# EAGLE design MinieasyMySens-v003 (EAGLE 7.3.0)
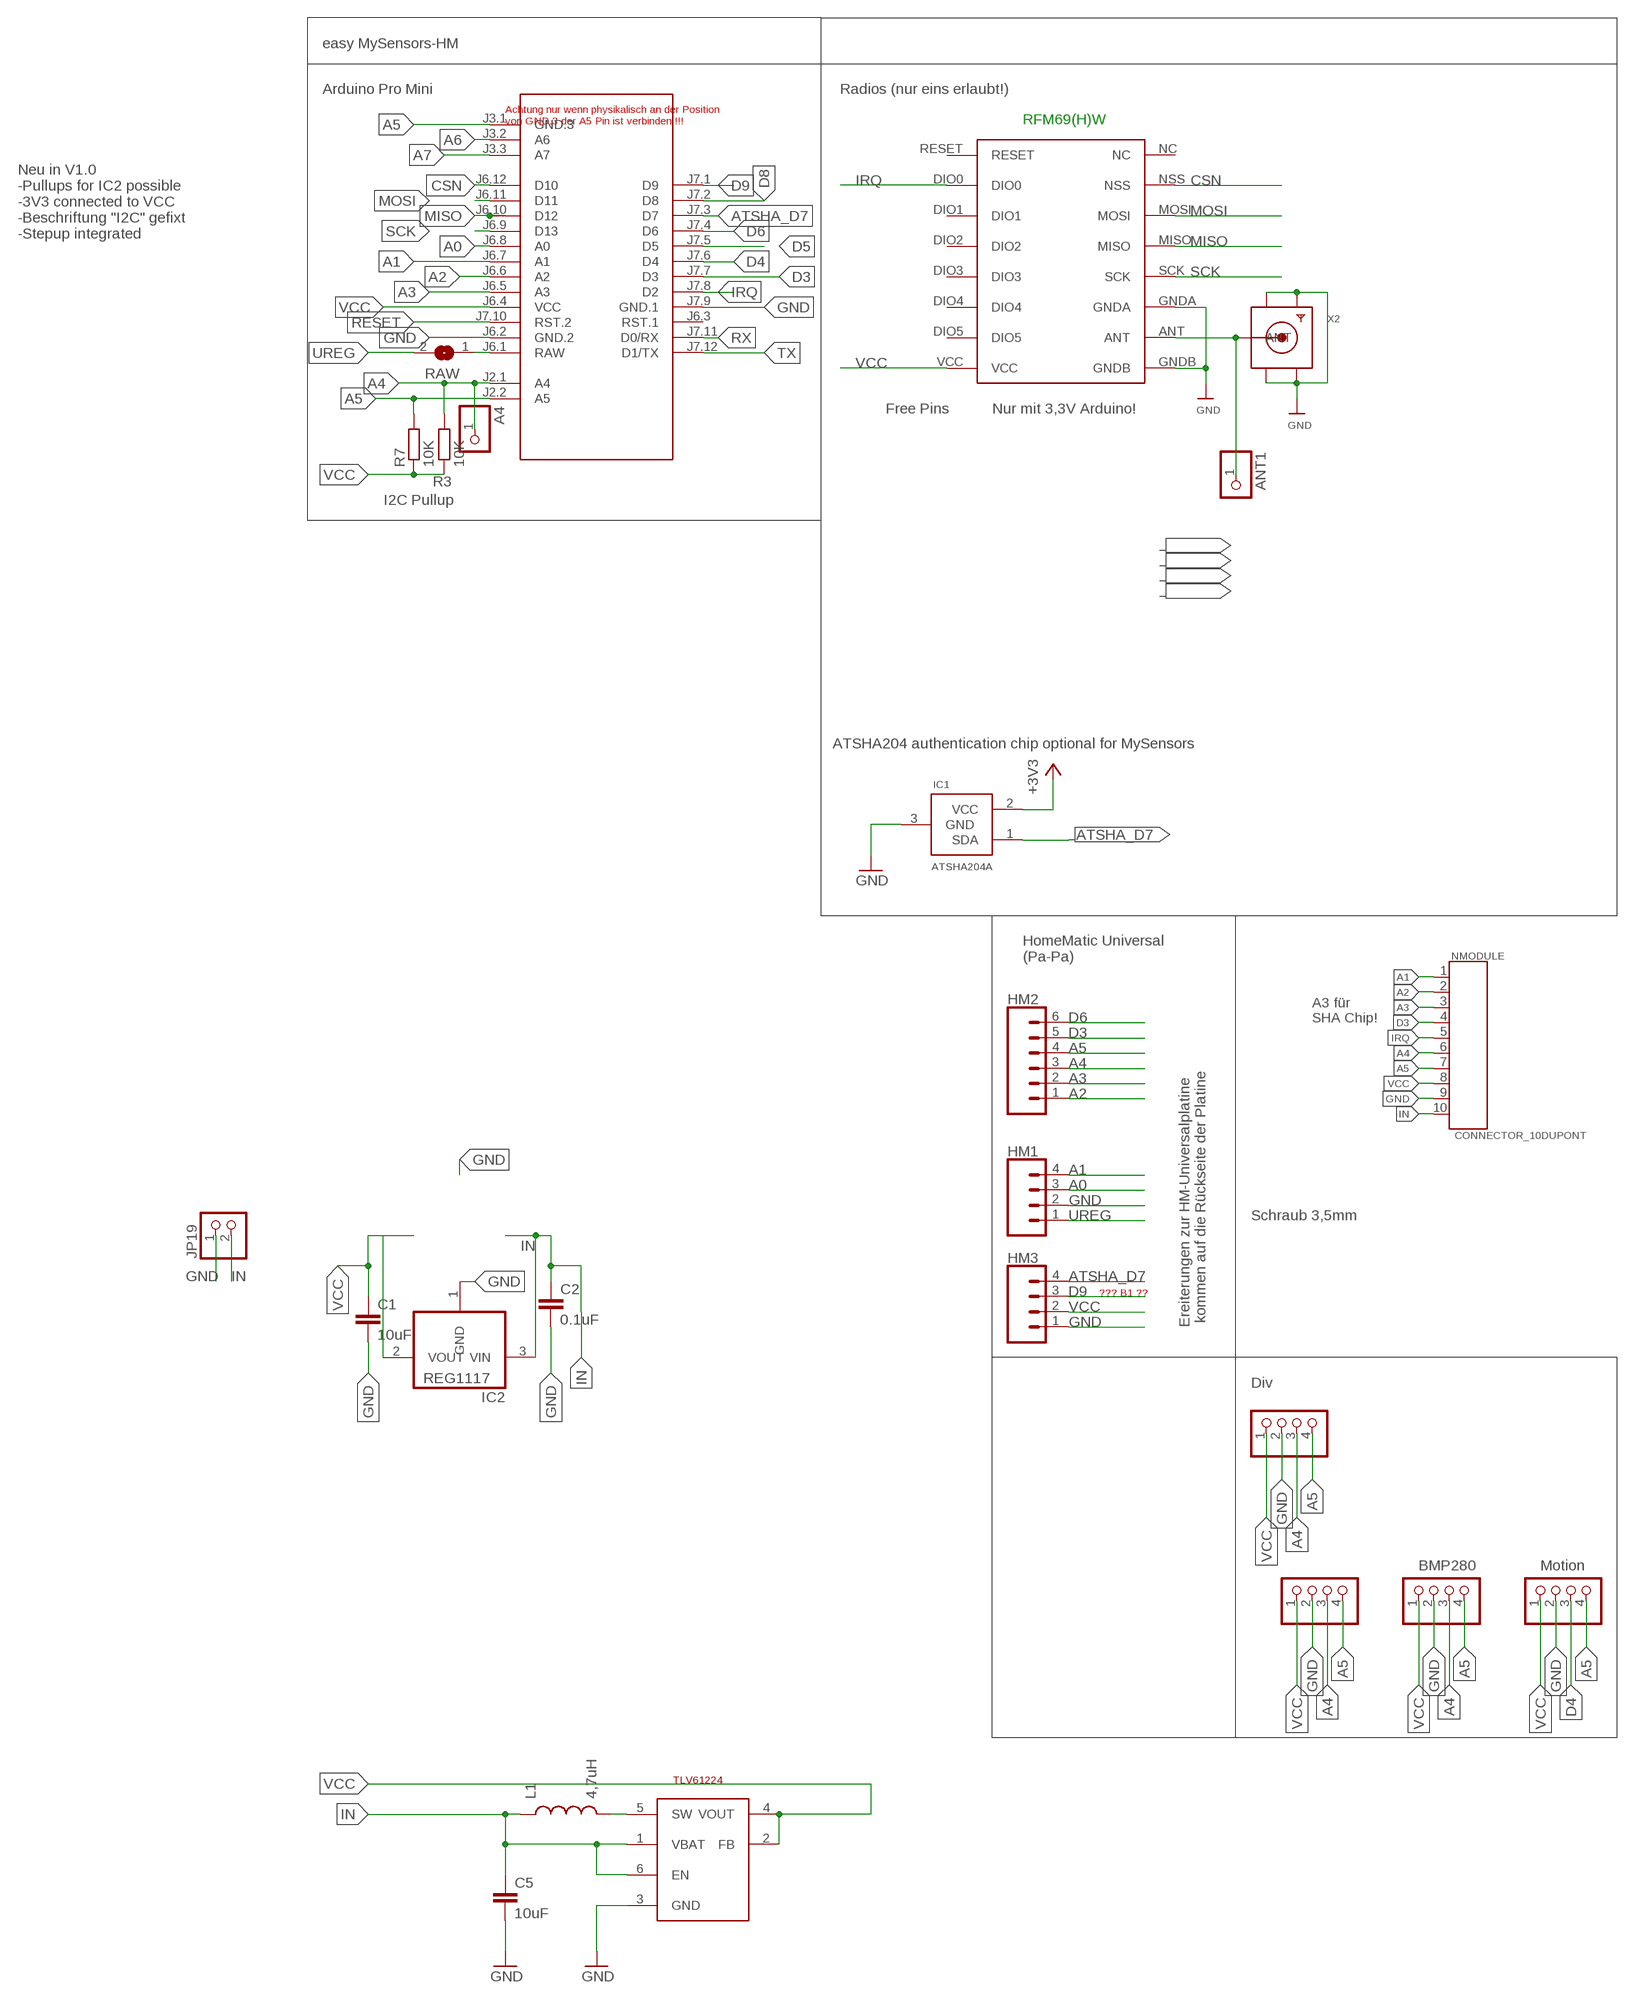
[diagram p0: schematic, sheet 1]

## Parts
A4  PINHD-1X1  [1X01]
ANT1  PINHD-1X1  [1X01]
BH1750  PINHD-1X04_2.54-S  [1X04-S]
C1  10uF  C-EUC1210  [C1210]
C2  0.1uF  C-EUC1206  [C1206]
C5  10uF  CAP0805  [0805]
HM1  CONN_04  [1X04]
HM2  CONN_06SILK_FEMALE_PTH  [1X06]
HM3  CONN_04  [1X04]
I2C-1  PINHD-1X04_2.54-S  [1X04-S]
I2C-2  PINHD-1X04_2.54-S  [1X04-S]
IC1  ATSHA204A  [SOT23]
IC2  REG1117  [SOT223]
JP19  PINHD-1X2  [1X02]
L1  4,7uH  INDUCTOR0805  [0805]
M1  ARDUINO-PRO-MINI-3.3V#NP  [ARDUINO-PRO-MINI#NP]
MOTION  PINHD-1X04_2.54-S  [1X04-S]
NMODULE  CONNECTOR_10DUPONT  [DUPONT_10]
R3  10K  R-EU_R0805  [R0805]
R7  10K  R-EU_R0805  [R0805]
RAW  SJ  [SJ]
RFM69W  RFM69HW  [RFM]
STEPUP  TLV61224  TI-TLV61224  [SOT23-6L]
X2  SMACONNECTOR_EDGE  [SMA_EDGELAUNCH]

## Nets
A0: HM1.3 M1.J6.8(A0)
A1: HM1.4 M1.J6.7(A1) NMODULE.1
A2: HM2.1 M1.J6.6(A2) NMODULE.2
A3: HM2.2 M1.J6.5(A3) NMODULE.3
A4: A4.1 BH1750.3 HM2.3 I2C-1.3 I2C-2.3 M1.J2.1(A4) NMODULE.6 R3.2
A5: BH1750.4 HM2.4 I2C-1.4 I2C-2.4 M1.J2.2(A5) M1.J3.1(GND.3) MOTION.4 NMODULE.7 R7.2
A6: M1.J3.2(A6)
A7: M1.J3.3(A7)
ATSHA_D7: HM3.4 IC1.1(SDA) M1.J7.3(D7)
CSN: M1.J6.12(D10) RFM69W.NSS
D3: HM2.5 M1.J7.7(D3) NMODULE.4
D4: M1.J7.6(D4) MOTION.3
D5: M1.J7.5(D5)
D6: HM2.6 M1.J7.4(D6)
D8: M1.J7.2(D8)
D9: HM3.3 M1.J7.1(D9)
GND [Power]: BH1750.2 C1.2 C2.2 C5.2 HM1.2 HM3.1 I2C-1.2 I2C-2.2 IC1.3(GND) IC2.1(GND) JP19.1 M1.J6.2(GND.2) M1.J7.9(GND.1) MOTION.2 NMODULE.9 RFM69W.GNDA RFM69W.GNDB STEPUP.3(GND) X2.GND@1(GND4) X2.GND@2(GND3) X2.GND@3(GND2) X2.GND@4(GND1)
IN [Power]: C2.1 C5.1 IC2.3(VIN) JP19.2 L1.1 NMODULE.10 STEPUP.1(VBAT) STEPUP.6(EN)
IRQ: M1.J7.8(D2) NMODULE.5 RFM69W.DIO0
MISO: M1.J6.10(D12) RFM69W.MISO
MOSI: M1.J6.11(D11) RFM69W.MOSI
N$13: L1.2 STEPUP.5(SW)
N$16: ANT1.1 RFM69W.ANT X2.P(ANT)
RAW [Power]: M1.J6.1(RAW) RAW.1
RESET: M1.J7.10(RST.2)
RX: M1.J7.11(D0/RX)
SCK: M1.J6.9(D13) RFM69W.SCK
TX: M1.J7.12(D1/TX)
UREG [Power]: HM1.1 RAW.2
VCC [Power]: BH1750.1 C1.1 HM3.2 I2C-1.1 I2C-2.1 IC1.2(VCC) IC2.2(VOUT) M1.J6.4(VCC) MOTION.1 NMODULE.8 R3.1 R7.1 RFM69W.VCC STEPUP.2(FB) STEPUP.4(VOUT) ; supply symbol labelled +3V3
Unconnected: M1.J6.3(RST.1) RFM69W.DIO1 RFM69W.DIO2 RFM69W.DIO3 RFM69W.DIO4 RFM69W.DIO5 RFM69W.NC RFM69W.RESET

## Notes on the sheet
- easy MySensors-HM
- Arduino Pro Mini | Radios (nur eins erlaubt!)
- Achtung nur wenn physikalisch an der Position 
  von GND.3 der A5 Pin ist verbinden !!!
- RFM69(H)W
- Neu in V1.0
  -Pullups for IC2 possible
  -3V3 connected to VCC
  -Beschriftung "I2C" gefixt
  -Stepup integrated
- Free Pins | Nur mit 3,3V Arduino!
- I2C Pullup
- ATSHA204 authentication chip optional for MySensors
- HomeMatic Universal
  (Pa-Pa)
- A3 für 
  SHA Chip!
- Schraub 3,5mm
- ??? B1 ??
- Ereiterungen zur HM-Universalplatine
   kommen auf die Rückseite der Platine
- Div
- BMP280 | Motion

## Library data of the parts
A4 ANT1 = pinhead:PINHD-1X1: PIN HEADER
BH1750 I2C-1 I2C-2 MOTION = pinhead-2:PINHD-1X04: PIN HEADER
C1 C2 = rcl:C-EU: CAPACITOR, European symbol
C5 = SparkFun-Passives:CAP: Capacitor Standard 0603 ceramic capacitor, and 0.1" leaded capacitor.
HM1 HM3 = SparkFun-Connectors:CONN_04: Multi connection point. Often used as Generic Header-pin footprint for 0.1 inch spaced/style header connections On any of the 0.1 inch spaced packages, you can populate with these: Break Away Headers - Straight <https://www.sparkfun.com/products/116> (PRT-00116) Break Away Male Headers - Right Angle <https://www.sparkfun.com/products/553> (PRT-00553) Female Headers <https://www.sparkfun.com/products/115> (PRT-00115) Break Away Headers - Machine Pin <https://www.sparkfun.com/products/117> (PRT-00117) Break Away Female Headers - Swiss Machine Pin <https://www.sparkfun.com/products/743> (PRT-00743) For SCREWTERMINALS and SPRING TERMINALS visit here: Screw Terimnals on SparkFun.com <https://www.sparkfun.com/search/results?term=Screw+Terminals> (5mm/3.5mm/2.54mm spacing) This device is also useful as a general connection point to wire up your design to another part of your project. Our various solder wires solder well into these plated through hole pads. Hook-Up Wire - Assortment (Stranded, 22 AWG) <https://www.sparkfun.com/products/11375> (PRT-11375) Hook-Up Wire - Assortment (Solid Core, 22 AWG) <https://www.sparkfun.com/products/11367> (PRT-11367) View the entire wire category on our website here <https://www.sparkfun.com/categories/141> Special notes: Molex polarized connector foot print use with SKU : PRT-08231 with associated crimp pins and housings. 1MM SMD Version SKU: PRT-10208; PROD_ID: CONN-09696
HM2 = SparkFun-Connectors:CONN_06: Multi connection point. Often used as Generic Header-pin footprint for 0.1 inch spaced/style header connections On any of the 0.1 inch spaced packages, you can populate with these: Break Away Headers - Straight <https://www.sparkfun.com/products/116> (PRT-00116) Break Away Male Headers - Right Angle <https://www.sparkfun.com/products/553> (PRT-00553) Female Headers <https://www.sparkfun.com/products/115> (PRT-00115) Break Away Headers - Machine Pin <https://www.sparkfun.com/products/117> (PRT-00117) Break Away Female Headers - Swiss Machine Pin <https://www.sparkfun.com/products/743> (PRT-00743) Arduino Stackable Header - 6 Pin <https://www.sparkfun.com/products/9280> (PRT-09280) For SCREWTERMINALS and SPRING TERMINALS visit here: Screw Terimnals on SparkFun.com <https://www.sparkfun.com/search/results?term=Screw+Terminals> (5mm/3.5mm/2.54mm spacing) This device is also useful as a general connection point to wire up your design to another part of your project. Our various solder wires solder well into these plated through hole pads. Hook-Up Wire - Assortment (Stranded, 22 AWG) <https://www.sparkfun.com/products/11375> (PRT-11375) Hook-Up Wire - Assortment (Solid Core, 22 AWG) <https://www.sparkfun.com/products/11367> (PRT-11367) View the entire wire category on our website here <https://www.sparkfun.com/categories/141>; PROD_ID: CONN-08437
IC1 = Sensor:ATSHA204A
IC2 = burr-brown:REG1117: 800mA and 1A Low Dropout (LDO) Positive Regulator 1.8V, 2.5V, 2.85V, 3.3V, 5V, and Adj; MPN: REG1117; OC_FARNELL: 1097566; OC_NEWARK: 14P6981
JP19 = pinhead:PINHD-1X2: PIN HEADER
L1 = SparkFun-Passives:INDUCTOR: Inductors Basic Inductor/Choke - 0603 and 1206. Footprints are not proven and vary greatly between part numbers.
M1 = diy-modules:ARDUINO-PRO-MINI-*#NP: Arduino Pro Mini without programming pads
NMODULE = TD-MySensors:CONNECTOR_10
R3 R7 = rcl:R-EU_: RESISTOR, European symbol
RAW = jumper:SJ: SMD solder JUMPER
RFM69W = hoperf:RFM69HW
STEPUP = TLV61224:TI-TLV61224
X2 = adafruit:SMACONNECTOR: SMA Connector 90° DIP SMA Connector, 50 Ohm (4UConnector: 07259)

## Net classes
0 default: width 0.305 mm
1 Power: width 0.508 mm

## Board
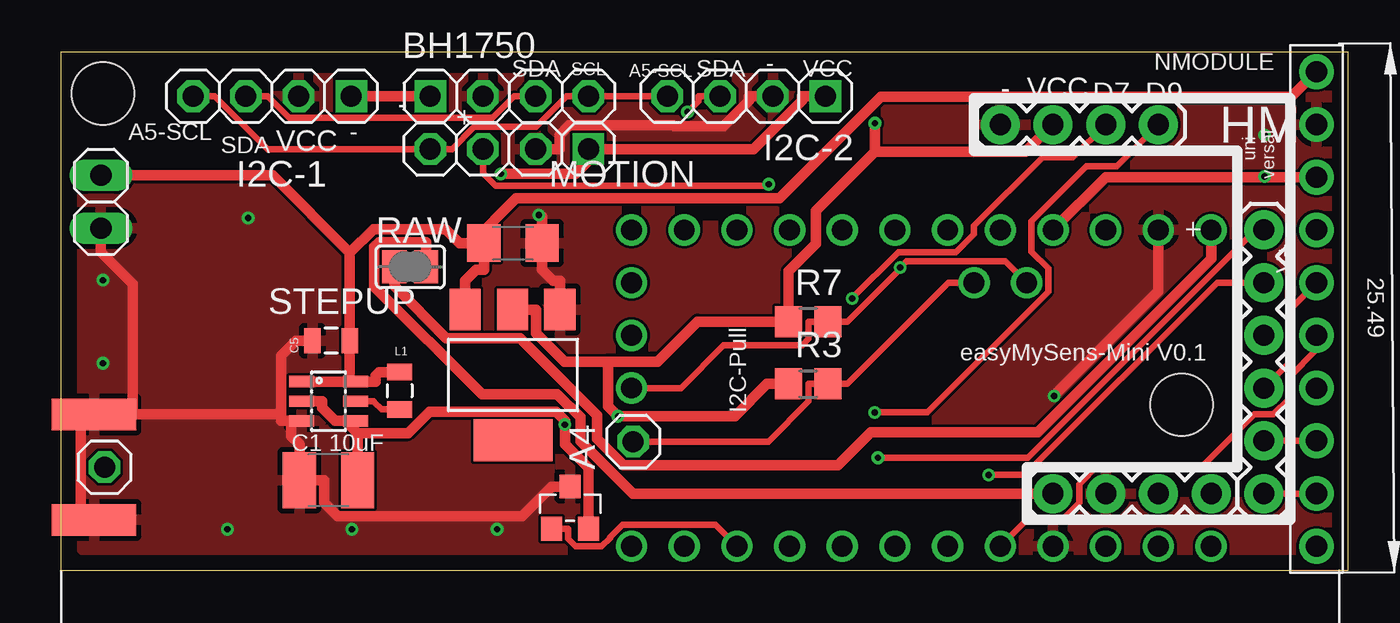
[diagram p1: board, top side]
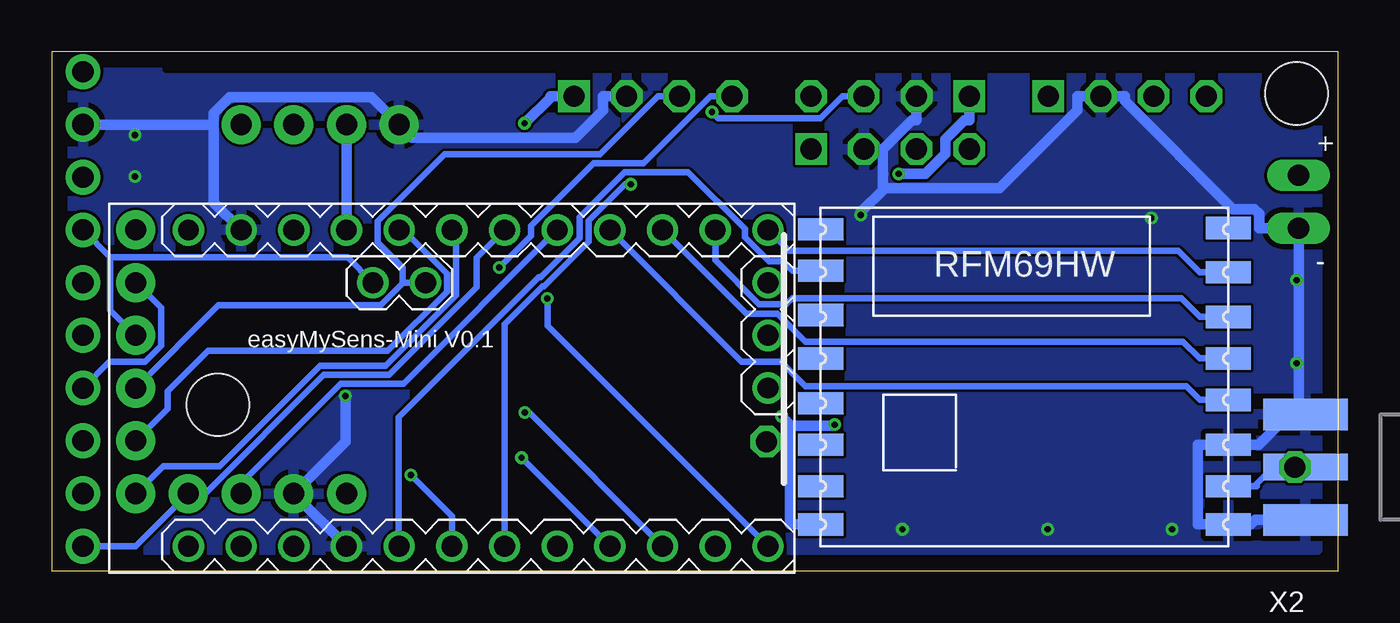
[diagram p2: board, bottom side, seen from below]

Size 62 x 25 mm. Coordinates in mm from the lower left corner, seen from the top.
Outline: 62,0 0,0 0,25 62,25 62,0
Copper layers (1*16): Top 0.035mm / dielectric 1.5mm / Bottom 0.035mm
Design rules "dirt_cheap_dirty_boards.v1": minimum track width 5mil, minimum drill 12mil, track to track 5mil, track to pad 5mil, pad to pad 5mil, via to via 5mil, smd to smd 0mil, copper to edge 10mil, drill to drill 10mil, minimum pad ring 10mil, minimum via ring 6mil, stop-mask expansion 2mil, vias tented up to drill 25mil, thermal gap 10mil
Holes 3 mm at 2,23 54,8
tRestrict: area 0,24.1 to 56.5,25.4; 2 lines
bRestrict: area 0,24.1 to 56.5,25.4; 2 lines

### Footprints (pad centres in the part's own frame; a part is rotated, then mirrored left to right if it is on the bottom)
1X01 = drill 1.016 octagon: 1 0,0
1X04-S = drill 1.016 square: 1 -3.81,0 | drill 1.016 octagon: 2 -1.27,0; 3 1.27,0; 4 3.81,0
C1210 = smd 1.6 x 2.7: 1 -1.4,0; 2 1.4,0
C1206 = smd 1.6 x 1.8: 1 -1.4,0; 2 1.4,0
0805 = smd 0.8 x 1.2: 1 -0.9,0; 2 0.9,0
1X04 = drill 1.016 pad 1.88: 1 0,0; 2 2.54,0; 3 5.08,0; 4 7.62,0
1X06 = drill 1.016 pad 1.88: 1 0,0; 2 2.54,0; 3 5.08,0; 4 7.62,0; 5 10.16,0; 6 12.7,0
SOT23 = smd 1.016 x 1.143: 1 -0.889,-1.016; 2 0.889,-1.016; 3 0,1.016
SOT223 = smd 1.499 x 2.007: 1 -2.261,-3.15; 2 0.025,-3.15; 3 2.311,-3.15 | smd 3.81 x 2.007: 4 0,3.15
1X02 = drill 1.016 long: 1 -1.27,0; 2 1.27,0
ARDUINO-PRO-MINI#NP = drill 1: J2.1 -1.27,5.08; J2.2 -3.81,5.08; J3.1 15.24,0; J3.2 15.24,2.54; J3.3 15.24,5.08; J6.1 -12.7,7.62; J6.2 -10.16,7.62; J6.3 -7.62,7.62; J6.4 -5.08,7.62; J6.5 -2.54,7.62; J6.6 0,7.62; J6.7 2.54,7.62; J6.8 5.08,7.62; J6.9 7.62,7.62; J6.10 10.16,7.62; J6.11 12.7,7.62; J6.12 15.24,7.62; J7.1 15.24,-7.62; J7.2 12.7,-7.62; J7.3 10.16,-7.62; J7.4 7.62,-7.62; J7.5 5.08,-7.62; J7.6 2.54,-7.62; J7.7 0,-7.62; J7.8 -2.54,-7.62; J7.9 -5.08,-7.62; J7.10 -7.62,-7.62; J7.11 -10.16,-7.62; J7.12 -12.7,-7.62
DUPONT_10 = drill 1.016 pad 1.676: 1 1.27,1.27; 2 3.81,1.27; 3 6.35,1.27; 4 8.89,1.27; 5 11.43,1.27; 6 13.97,1.27; 7 16.51,1.27; 8 19.05,1.27; 9 21.59,1.27; 10 24.13,1.27
R0805 = smd 1.3 x 1.5: 1 -0.95,0; 2 0.95,0
SJ = smd 1.168 x 1.6: 1 -0.762,0; 2 0.762,0
RFM = smd 2.184 x 1.067: ANT 19.651,2.889; DIO0 0,13.27; DIO1 0,11.143; DIO2 0,9.047; DIO3 0,6.889; DIO4 0,4.889; DIO5 0,2.889; GNDA 19.651,4.889; GNDB 19.651,1.048; MISO 19.651,9.047; MOSI 19.651,11.047; NC 19.651,15.334; NSS 19.651,13.206; RESET 0,15.27; SCK 19.651,7.048; VCC 0,1.048
SOT23-6L = smd 0.55 x 1.2: 1 -0.95,-1.3; 2 0,-1.3; 3 0.95,-1.3; 4 0.95,1.3; 5 0,1.3; 6 -0.95,1.3
SMA_EDGELAUNCH = smd 4.064 x 1.524: GND@1 2.032,-2.54; GND@2 2.032,2.54 | smd 4.064 x 1.524 bottom: GND@3 2.032,2.54; GND@4 2.032,-2.54 | smd 4.064 x 1.27: P 2.032,0

### Placement (x,y rotation side)
A4  27.56,6.22 90 top
ANT1  2.08,4.99 0 top
BH1750  21.59,22.86 0 top
C1  12.88,4.36 180 top
C2  21.77,15.79 0 top
C5  13,11.09 180 top
HM1  47.8,3.72 0 top
HM2  57.96,3.72 90 top
HM3  45.26,21.5 0 top
I2C-1  10.16,22.86 180 top
I2C-2  33.02,22.86 180 top
IC1  24.52,3.04 0 top
IC2  21.77,9.44 180 top
JP19  1.91,17.78 90 top
L1  16.3,8.67 270 top
M1  42.72,8.8 0 bottom
MOTION  21.59,20.32 180 top
NMODULE  61.77,-0.09 90 top
R3  36,9 0 top
R7  36,12 0 top
RAW  16.81,14.64 0 top
RFM69W  24.94,1.18 0 bottom
STEPUP  12.88,8.16 270 top
X2  -0.46,4.99 180 bottom

### Tracks (layer width: path | path; a pad name or v marks a point on that pad's centre or on a via)
A0
  Bottom 0.305: HM1.3 52.88,4.22 48.09,9.01 45.05,9.01 M1.J6.8
A1
  Bottom 0.305: M1.J6.7 41.52,15.08 41.52,13.66 45.74,9.44 48.89,9.44 54.61,3.72 HM1.4 57.96,1.18 NMODULE.1
A2
  Top 0.305: NMODULE.2 HM2.1
  Bottom 0.305: HM2.1 56.64,5.04 53.9,5.04 49.07,9.87 45.92,9.87 42.52,13.27 42.52,16.22 M1.J6.6
A3
  Top 0.305: NMODULE.3 HM2.2
  Bottom 0.305: HM2.2 56.41,7.81 56.41,8.65 54.46,10.6 45.81,10.6 42.96,13.45 42.96,14.31 45.06,16.42 M1.J6.5
A4  (via drill 0.3 pad 0.61)
  Top 0.305: v30.18,22.1 30.71,22.63 30.71,22.86 I2C-2.3 | I2C-1.3 9.93,22.86 10.97,21.82 20.78,21.82 21.82,22.86 BH1750.3 | A4.1 34.07,6.22 36.02,8.17 36.02,9 R3.2 37.88,9 42.76,13.88 M1.J2.1 | NMODULE.6 59.3,12.68 59.3,10.14 HM2.3
  Bottom 0.305: v30.18,22.1 29.89,21.81 24.95,21.81 23.9,22.86 BH1750.3 | 45.09,13.88 45.09,14.61 46.29,15.82 46.29,16.85 43.07,20.07 35.58,20.07 32.79,22.86 I2C-2.3 | HM2.3 53.98,12.78 46.16,12.78 45.09,13.85 45.09,13.88 | M1.J2.1 45.09,13.88
A5  (via drill 0.3 pad 0.61)
  Top 0.305: I2C-2.4 BH1750.4 24.36,22.86 22.89,21.39 19.89,21.39 18.82,20.32 MOTION.4 9.93,20.32 7.39,22.86 I2C-1.4 | M1.J2.2 45.49,14.92 40.74,14.92 v40.43,14.61 40.43,14.55 37.88,12 R7.2 36.87,12 36.02,12 36.02,11.17 35.71,10.86 31.92,10.86 29.86,8.8 M1.J3.1
  Bottom 0.305: I2C-2.4 30.25,22.86 33.47,19.64 35.88,19.64 38.91,16.62 38.91,16.13 v40.43,14.61 | 59.18,15.1 59.18,12.56 HM2.4 | NMODULE.7 59.18,15.1 | M1.J2.2 47.75,15.1 59.18,15.1
ATSHA_D7  (via drill 0.3 pad 0.61)
  Top 0.305: v39.21,7.63 41.74,7.63 47.56,13.45 47.56,14.58 46.76,15.38 46.76,16.85 49.41,19.49 50.87,19.49 HM3.4 | IC1.1 24.42,2.02 24.42,1.53 24.79,1.17 26.05,1.17 26.45,1.57 26.45,1.61 27.05,2.21 31.53,2.21 M1.J7.3
  Bottom 0.305: M1.J7.3 39.01,7.63 v39.21,7.63
CSN
  Bottom 0.305: RFM69W.NSS 6.66,14.39 7.69,15.42 26.48,15.42 M1.J6.12
D3  (via drill 0.3 pad 0.61)
  Top 0.305: v44.7,4.62 46.44,4.62 55.71,13.88 HM2.5
  Bottom 0.305: v44.7,4.62 42.72,2.64 M1.J7.7 | NMODULE.4 59.23,10.07 57.5,10.07 56.74,10.83 56.74,12.66 HM2.5
D4  (via drill 0.3 pad 0.61)
  Top 0.305: v34.1,18.62 34.01,18.54 20.94,18.54 20.32,19.16 20.32,19.28 MOTION.3
  Bottom 0.305: M1.J7.6 40.18,11.88 38.35,13.71 38.27,13.71 36.13,15.85 36.13,16.86 34.37,18.62 v34.1,18.62
D6  (via drill 0.3 pad 0.61)
  Top 0.305: v39.36,5.44 46.59,5.44 57.57,16.42 HM2.6
  Bottom 0.305: M1.J7.4 v39.36,5.44
D9  (via drill 0.3 pad 0.61)
  Top 0.305: v38.11,13.12 40.34,15.35 43.12,15.35 43.99,16.22 43.99,16.61 47.3,19.93 48.77,19.93 HM3.3
  Bottom 0.305: M1.J7.1 38.11,11.81 v38.11,13.12
GND  (via drill 0.3 pad 0.61)
  Top 0.508: M1.J6.2 52.88,13.46 v47.85,8.43 | I2C-2.2 33.15,22.86 33.15,22.64 31.92,21.41 29.55,21.41 29.5,21.46 24.48,21.46 24,20.99 24,20.32 MOTION.2 | v23.02,17.15 23.1,17.07 23.16,17.07 C2.2 23.16,14.5 23.7,13.97 24.03,13.97 IC2.1 | 11.09,7.21 11.09,6.48 11.47,6.09 C1.2 12.66,4.36 12.66,3.29 13.32,2.62 22.2,2.62 23.64,4.05 IC1.3 | 11.09,7.21 10.59,7.21 10.59,7.53 | STEPUP.3 11.09,7.21 | 10.59,7.53 10.59,10.35 11.32,11.09 C5.2 | 3.44,7.53 10.59,7.53 | 3.44,7.53 3.44,13.83 1.91,15.37 JP19.1 | 3.44,7.53 X2.GND@1 0.93,6.89 0.93,3.09 X2.GND@3
  Bottom 0.508: v47.85,8.43 47.85,6.21 HM1.2 M1.J7.9 | 21.84,18.44 21.94,18.53 21.94,20.32 | 21.84,18.44 16.32,18.44 12.57,22.19 12.57,22.86 I2C-1.2 10.29,22.86 10.29,22.64 5.08,17.43 4.03,17.43 3.81,17.21 3.81,16.51 JP19.1 1.91,7.86 | 21.84,18.44 23.02,17.27 v23.02,17.15 | BH1750.2 20.32,21.72 20.54,21.72 21.94,20.32 | MOTION.2 21.94,20.32 | 54.2,21.5 54.2,17.74 M1.J6.2 | 54.2,21.5 54.2,22.05 53.43,22.82 46.58,22.82 HM3.1 44.63,20.87 36.75,20.87 35.43,22.19 35.43,22.86 I2C-2.2 | NMODULE.9 54.2,21.5 | 1.91,7.86 X2.GND@1 | 1.91,7.86 2.02,7.86 3.82,6.07 4.55,6.07 RFM69W.GNDA 6.76,6.07 6.76,2.23 RFM69W.GNDB 4.21,2.23 3.98,2.45 X2.GND@3
  other vias: 9,17 2,14 2,10 8,2 14,2 21,2 58,21 58,19
  pour Bottom: 1,1 1,24 61,24 61,1
  pour Top: 1,1 1,24 61,24 61,1
IN
  Top 0.508: NMODULE.10 59.29,22.83 39.51,22.83 34.62,17.94 21.93,17.94 19.77,15.79 | 19.77,15.79 19.18,15.79 18.51,16.46 15.04,16.46 13.9,15.32 | 19.77,15.79 C2.1 20.36,14.5 19.99,14.5 19.45,13.97 IC2.3 | 13.9,15.32 C5.1 13.9,9.12 | JP19.2 10.18,19.05 13.9,15.32 | L1.1 15.32,9.57 15.16,9.41 15.16,9.12 STEPUP.6 13.9,9.12 | STEPUP.1 13.9,9.12
IRQ
  Top 0.305: M1.J7.8 46.58,2.5 48.31,2.5 49.07,3.26 49.07,4.18 49.97,5.07 55.05,5.07 57.5,7.53 58.41,7.53 59.18,8.29 59.18,9.32 60.5,10.64 NMODULE.5
  Bottom 0.305: M1.J7.8 45.28,1.2 45.28,7.39 38.53,14.14 38.45,14.14 36.56,16.03 36.56,17.04 34.39,19.21 31.34,19.21 28.6,16.47 28.6,16.08 27.43,14.91 26.77,14.91 26.31,14.45 RFM69W.DIO0
MISO
  Bottom 0.305: RFM69W.MISO 6.66,10.23 7.47,11.04 25.69,11.04 27.02,12.37 28.51,12.37 M1.J6.10
MOSI
  Bottom 0.305: RFM69W.MOSI 6.66,12.23 7.57,13.13 26.31,13.13 26.6,12.84 27.91,12.84 30.02,14.96 M1.J6.11
N$13
  Top 0.305: STEPUP.5 15.05,8.16 15.05,8.14 15.43,7.77 L1.2
N$16
  Bottom 0.305: RFM69W.ANT 3.92,4.07 3.92,4.19 3.12,4.99 ANT1.1 X2.P
RAW
  Top 0.508: RAW.1 16.05,13.7 18.55,11.2 22.1,11.2 25.81,7.49 25.81,6.36 27.08,5.08 37.43,5.08 39.02,6.67 47.07,6.67 55.42,15.03 M1.J6.1
SCK
  Bottom 0.305: RFM69W.SCK 6.66,8.23 7.31,8.88 25.66,8.88 26.85,10.07 28.75,10.07 M1.J6.9
UREG
  Top 0.508: HM1.1 27.55,3.72 25.02,6.25 25.02,7.39 23.9,8.5 20.27,8.5 15.08,13.68 15.08,15.6 15.3,15.82 17.57,15.82 RAW.2
VCC  (via drill 0.3 pad 0.61)
  Top 0.508: 25.97,20.32 24.77,19.12 v21.18,19.12 | 25.97,20.32 26.54,20.32 33.37,20.32 35.69,22.64 35.69,22.86 I2C-2.1 | MOTION.1 25.97,20.32 | 39.21,20.18 v39.21,21.56 | 39.21,20.18 36.37,17.34 36.37,15.76 35.05,14.44 R7.1 30.67,12 28.74,10.07 26.34,10.07 | 39.21,20.18 46.48,20.18 HM3.2 | M1.J6.4 50.34,18.96 NMODULE.8 | 26.34,10.07 26.34,7.93 v26.83,7.45 32.46,7.45 34.02,9 R3.1 | 26.34,10.07 24.25,10.07 22.87,11.45 22.87,12.59 IC2.2 | 25.41,2.97 25.41,4.95 24.27,6.1 v24.27,7.04 24.27,7.23 23.83,7.67 17.75,7.67 16.7,6.62 14.28,6.62 | 25.41,2.97 | 14.28,6.62 13.68,7.21 | 14.28,6.62 14.28,5.93 C1.1 | IC1.2 25.41,2.97 | I2C-1.1 BH1750.1 | 13.68,7.21 13.19,7.21 12.56,7.85 12.56,8.16 STEPUP.2 | STEPUP.4 13.68,7.21
  Bottom 0.508: HM3.2 M1.J6.4 | BH1750.1 17.78,21.72 18,21.72 18.92,20.8 18.92,20.09 19.89,19.12 v21.18,19.12 | I2C-2.1 37.97,22.86 37.97,22.8 v39.21,21.56 | 26.36,6.98 24.32,6.98 v24.27,7.04 | 26.36,6.98 26.41,6.93 26.41,2.23 RFM69W.VCC | 26.36,6.98 v26.83,7.45

### Text on the board
tPlace: HM | uni- / versal | easyMySens-Mini V0.1 | I2C-Pull
bPlace: easyMySens-Mini V0.1
tNames: SDA | SDA | SCL | A5-SCL | - | VCC | D7 | D9 | - | - | VCC | + | A5-SCL | - | SDA | VCC | + | V+ | C1 10uF | +
bNames: + | -